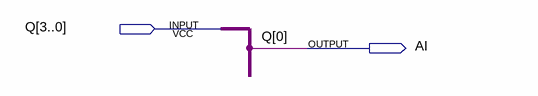
[diagram p0: schematic sheet]
// Quartus schematic AmarilloIzquierda.bdf as structural Verilog: 0 symbols, 2 pins
module AmarilloIzquierda (
  input  [3:0] Q,
  output AI
);


  assign AI = Q[0];
endmodule
